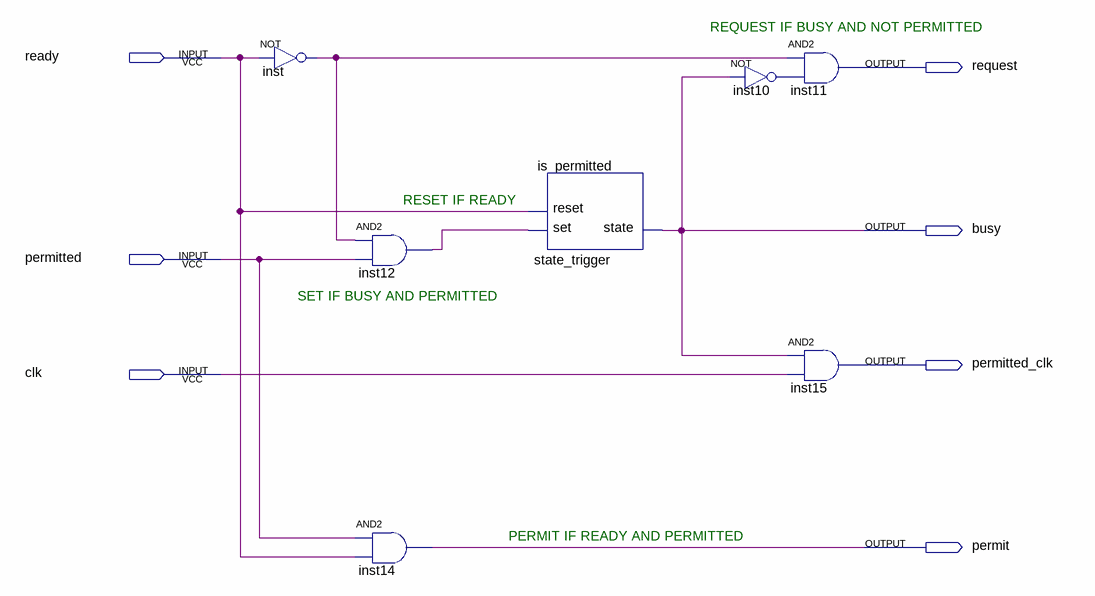
[diagram p0: schematic sheet]
// Quartus schematic DMA_check.bdf as structural Verilog: 7 symbols, 7 pins
module DMA_check (
  input  ready,
  input  permitted,
  input  clk,
  output request,
  output busy,
  output permitted_clk,
  output permit
);

  wire inst10_out, inst12_out, inst_out;

  not inst (inst_out, ready);
  and inst12 (inst12_out, inst_out, permitted);
  and inst14 (permit, permitted, ready);
  state_trigger is_permitted (.set(inst12_out), .reset(ready), .state(busy));
  and inst11 (request, inst_out, inst10_out);
  not inst10 (inst10_out, busy);
  and inst15 (permitted_clk, busy, clk);

  // Notes on the sheet:
  //   REQUEST IF BUSY AND NOT PERMITTED
  //   RESET IF READY
  //   SET IF BUSY AND PERMITTED
  //   PERMIT IF READY AND PERMITTED
endmodule
